# Altium schematic sheet I2C_ISO.SchDoc
size A; SheetNumber: 19; SheetTotal: 21
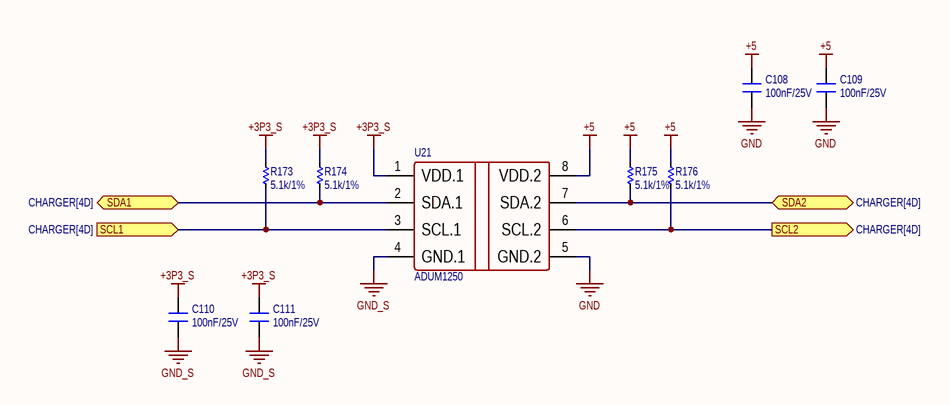
[diagram p0: I2C_ISO.SchDoc]

## Parts
C108  100nF/25V  [CN-SMD-0603]
C109  100nF/25V  [CN-SMD-0603]
C110  100nF/25V  [CN-SMD-0603]
C111  100nF/25V  [CN-SMD-0603]
R173  5.1k/1%  [RES-SMD-0603]
R174  5.1k/1%  [RES-SMD-0603]
R175  5.1k/1%  [RES-SMD-0603]
R176  5.1k/1%  [RES-SMD-0603]
U21  ADUM1250  [SO8]

## Ports
SCL1 (in, see CHARGER[4D]), SCL2 (out, see CHARGER[4D]), SDA1 (bidir, see CHARGER[4D]), SDA2 (bidir, see CHARGER[4D])

## Nets
+3P3_S: C110.1 C111.1 R173.1 R174.1 U21.1(VDD.1)
+5: C108.1 C109.1 R175.1 R176.1 U21.8(VDD.2)
GND: C108.2 C109.2 U21.5(GND.2)
GND_S: C110.2 C111.2 U21.4(GND.1)
SCL1: R173.2 U21.3(SCL.1) ; port SCL1
SCL2: R176.2 U21.6(SCL.2) ; port SCL2
SDA1: R174.2 U21.2(SDA.1) ; port SDA1
SDA2: R175.2 U21.7(SDA.2) ; port SDA2

## Library data of the parts
C108-C111 = CN: CL10B104KA8NNNC; PN: CL10B104KA8NNNC
R173-R176 = Res-SMD: ERJ-3EKF5101V; Manufacturer: Generic Components; Class: Passive; PN: ERJ-3EKF5101V; Publisher: Altium Hobart Technology Centre
U21 = ADUM1250: Hot Swappable, Dual I2C Isolators; PN: ADUM1250ARZ-RL7